# Altium project Thrust Stand Board.PrjPcb
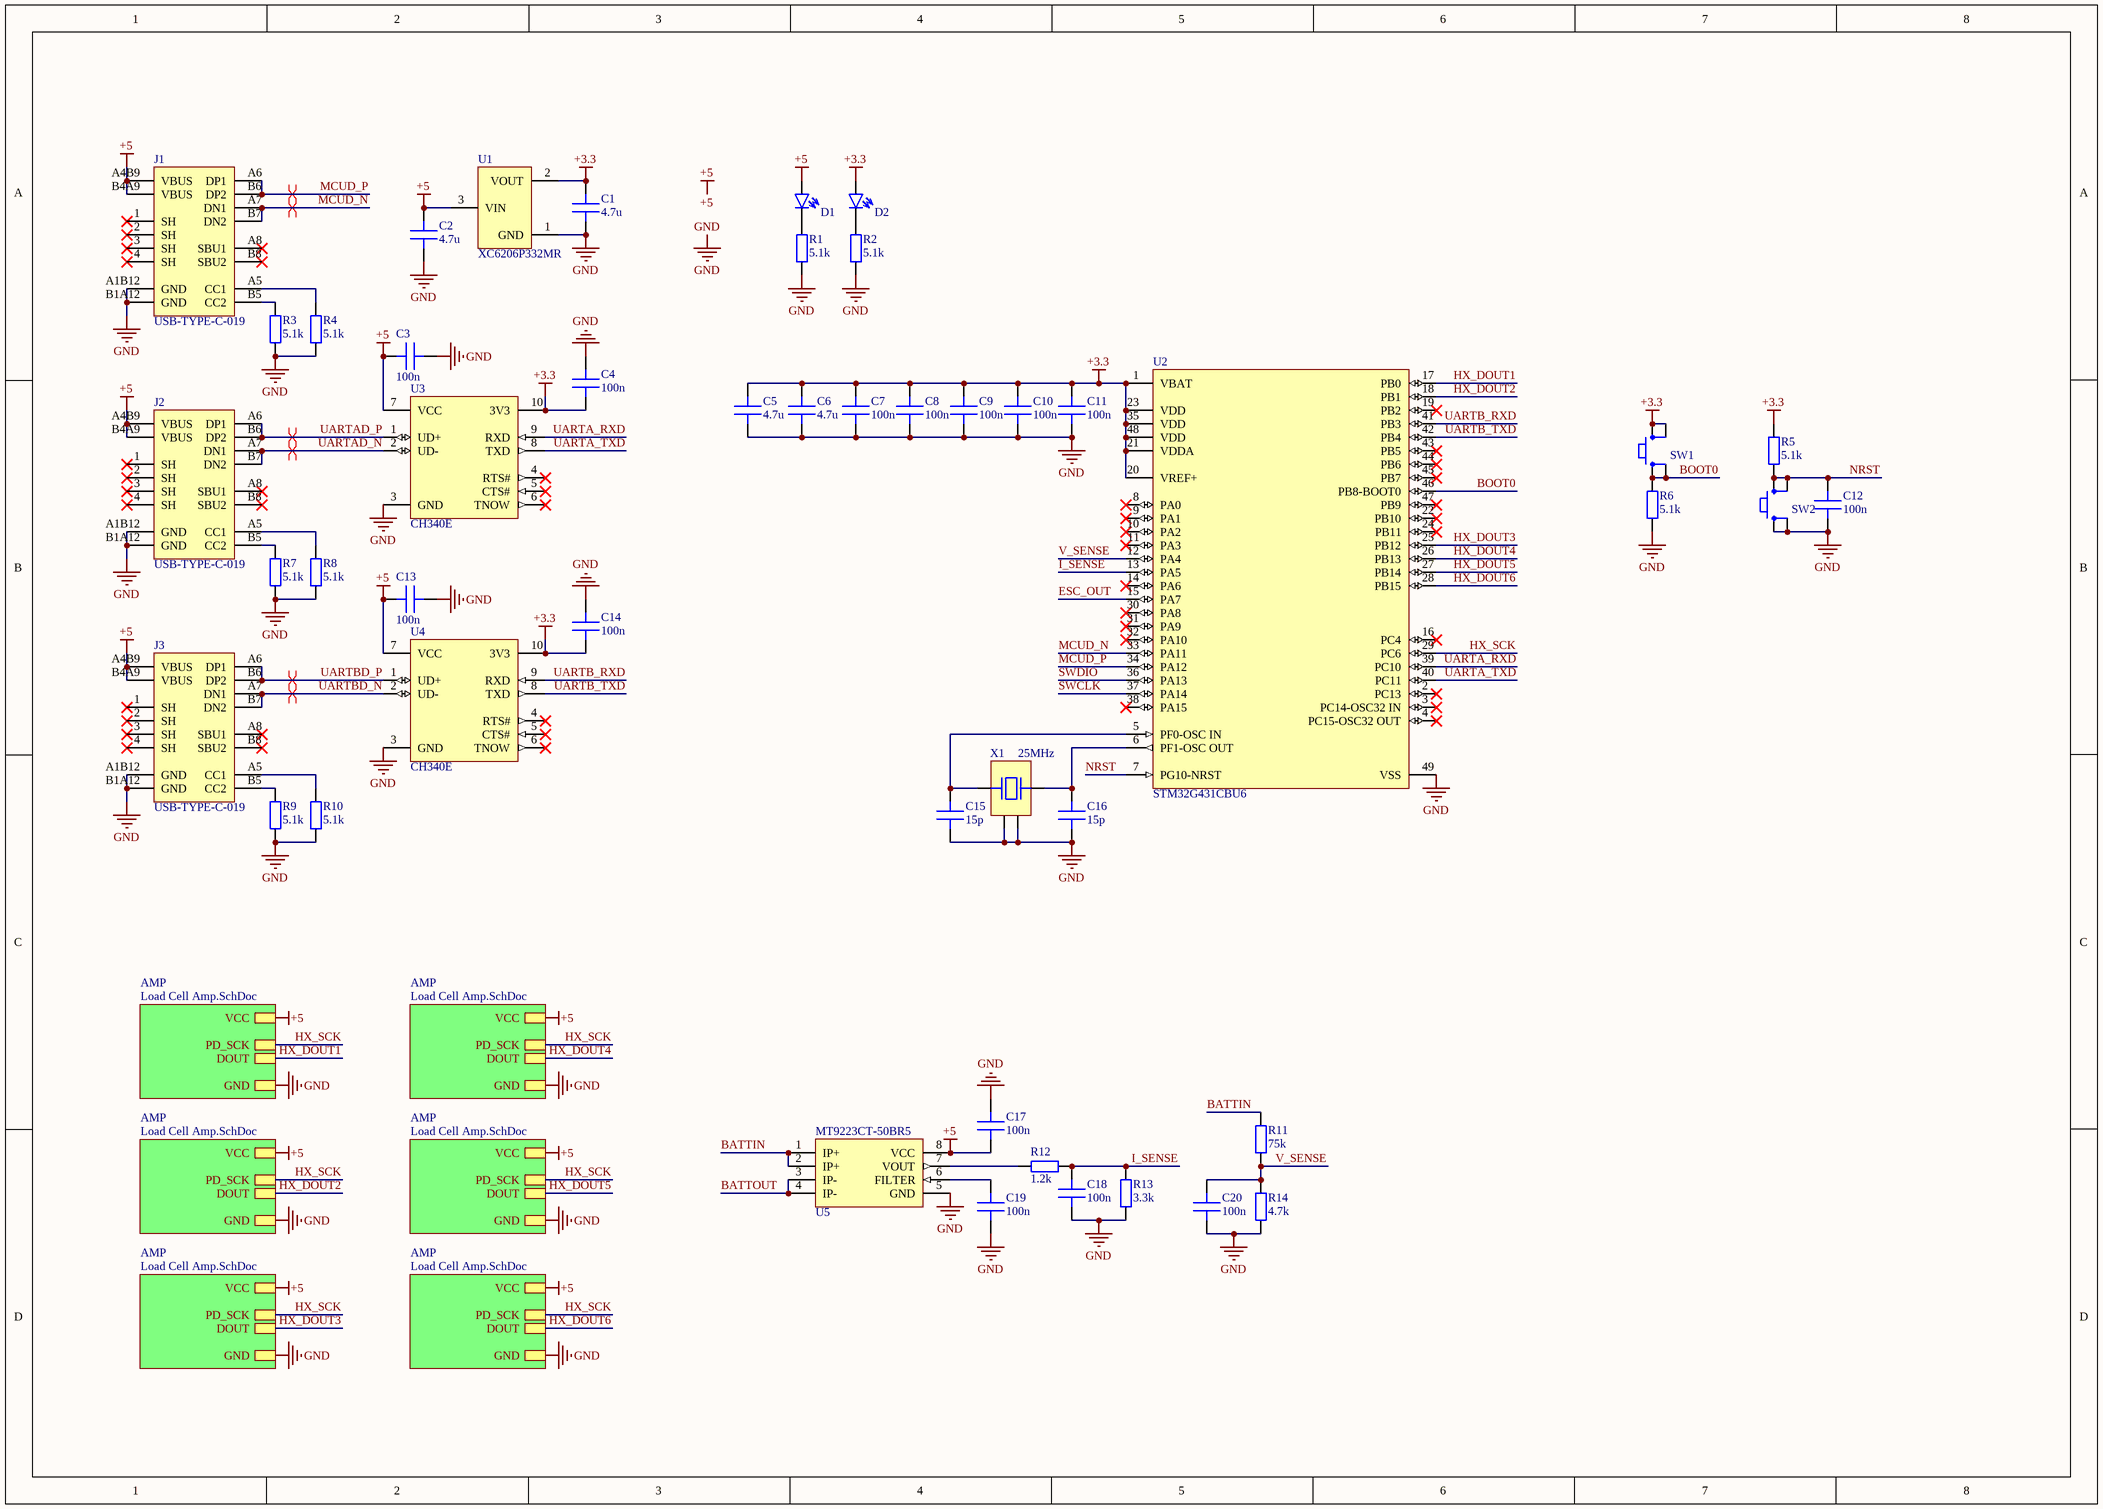
[diagram p0: Main.SchDoc]
1 sheet, 47 parts. Net scope: hierarchical (ports join the sheet entries above them; power ports are global).
Board files: Thrust Stand Board.PcbDoc, Panel.PcbDoc

## Sheet Main.SchDoc
size A3

### Parts
C1  4.7u  [IPC C C0603 NO SILK]
C2  4.7u  [IPC C C0603 NO SILK]
C3  100n  [IPC C C0402 NO SILK]
C4  100n  [IPC C C0402 NO SILK]
C5  4.7u  [IPC C C0603 NO SILK]
C6  4.7u  [IPC C C0603 NO SILK]
C7  100n  [IPC C C0402 NO SILK]
C8  100n  [IPC C C0402 NO SILK]
C9  100n  [IPC C C0402 NO SILK]
C10  100n  [IPC C C0402 NO SILK]
C11  100n  [IPC C C0402 NO SILK]
C12  100n  [IPC C C0402 NO SILK]
C13  100n  [IPC C C0402 NO SILK]
C14  100n  [IPC C C0402 NO SILK]
C15  15p  [IPC C C0402 NO SILK]
C16  15p  [IPC C C0402 NO SILK]
C17  100n  [IPC C C0402 NO SILK]
C18  100n  [IPC C C0402 NO SILK]
C19  100n  [IPC C C0402 NO SILK]
C20  100n  [IPC C C0402 NO SILK]
D1  Generic LED 0603  [IPC C D0603]  (value not drawn)
D2  Generic LED 0603  [IPC C D0603]  (value not drawn)
J1  USB-TYPE-C-019  [USB-TYPE-C-12+4P]
J2  USB-TYPE-C-019  [USB-TYPE-C-12+4P]
J3  USB-TYPE-C-019  [USB-TYPE-C-12+4P]
R1  5.1k  [IPC C R0402 NO SILK]
R2  5.1k  [IPC C R0402 NO SILK]
R3  5.1k  [IPC C R0402 NO SILK]
R4  5.1k  [IPC C R0402 NO SILK]
R5  5.1k  [IPC C R0402 NO SILK]
R6  5.1k  [IPC C R0402 NO SILK]
R7  5.1k  [IPC C R0402 NO SILK]
R8  5.1k  [IPC C R0402 NO SILK]
R9  5.1k  [IPC C R0402 NO SILK]
R10  5.1k  [IPC C R0402 NO SILK]
R11  75k  [IPC C R0402 NO SILK]
R12  1.2k  [IPC C R0402 NO SILK]
R13  3.3k  [IPC C R0402 NO SILK]
R14  4.7k  [IPC C R0402 NO SILK]
SW1  TS-1187A-B-A-B  [TS-1187A-B-A-B]  (value not drawn)
SW2  TS-1187A-B-A-B  [TS-1187A-B-A-B]  (value not drawn)
U1  XC6206P332MR  [SOT23-3]
U2  STM32G431CBU6  [QFN50P700X700X60_HS-49L]
U3  CH340E  [MSOP-UN10_L]
U4  CH340E  [MSOP-UN10_L]
U5  MT9223CT-50BR5  [SOP127P600X175-8L]
X1  25MHz  [OSC-SMD_4P-L3.2-W2.5-BL]

### Sub-sheets
AMP = Load Cell Amp.SchDoc (file not in this document): VCC, PD_SCK, DOUT, GND
AMP = Load Cell Amp.SchDoc (file not in this document): VCC, PD_SCK, DOUT, GND
AMP = Load Cell Amp.SchDoc (file not in this document): VCC, PD_SCK, DOUT, GND
AMP = Load Cell Amp.SchDoc (file not in this document): VCC, PD_SCK, DOUT, GND
AMP = Load Cell Amp.SchDoc (file not in this document): VCC, PD_SCK, DOUT, GND
AMP = Load Cell Amp.SchDoc (file not in this document): VCC, PD_SCK, DOUT, GND

### Nets
+3.3: C1.2 C4.2 C5.2 C6.2 C7.2 C8.2 C9.2 C10.2 C11.2 C14.2 D2.1(A) R5.2 SW1.3 SW1.4 U1.2(VOUT) U2.1(VBAT) U2.20(VREF+) U2.21(VDDA) U2.23(VDD) U2.35(VDD) U2.48(VDD) U3.10(3V3) U4.10(3V3)
+5: C2.2 C3.2 C13.2 C17.2 D1.1(A) J1.A4B9(VBUS) J1.B4A9(VBUS) J2.A4B9(VBUS) J2.B4A9(VBUS) J3.A4B9(VBUS) J3.B4A9(VBUS) U1.3(VIN) U3.7(VCC) U4.7(VCC) U5.8(VCC) ; sheet AMP/VCC, sheet AMP/VCC, sheet AMP/VCC, sheet AMP/VCC, sheet AMP/VCC, sheet AMP/VCC
GND: C1.1 C2.1 C3.1 C4.1 C5.1 C6.1 C7.1 C8.1 C9.1 C10.1 C11.1 C12.1 C13.1 C14.1 C15.1 C16.1 C17.1 C18.1 C19.1 C20.1 J1.A1B12(GND) J1.B1A12(GND) J2.A1B12(GND) J2.B1A12(GND) J3.A1B12(GND) J3.B1A12(GND) R1.1 R2.1 R3.1 R4.1 R6.2 R7.1 R8.1 R9.1 R10.1 R13.1 R14.1 SW2.1 SW2.2 U1.1(GND) U2.49(VSS) U3.3(GND) U4.3(GND) U5.5(GND) X1.2 X1.4 ; sheet AMP/GND, sheet AMP/GND, sheet AMP/GND, sheet AMP/GND, sheet AMP/GND, sheet AMP/GND
BATTIN: R11.2 U5.1(IP+) U5.2(IP+)
BATTOUT: U5.3(IP-) U5.4(IP-)
BOOT0: R6.1 SW1.1 SW1.2 U2.46(PB8-BOOT0)
ESC_OUT: U2.15(PA7)
HX_DOUT1: U2.17(PB0) ; sheet AMP/DOUT
HX_DOUT2: U2.18(PB1) ; sheet AMP/DOUT
HX_DOUT3: U2.25(PB12) ; sheet AMP/DOUT
HX_DOUT4: U2.26(PB13) ; sheet AMP/DOUT
HX_DOUT5: U2.27(PB14) ; sheet AMP/DOUT
HX_DOUT6: U2.28(PB15) ; sheet AMP/DOUT
HX_SCK: U2.29(PC6) ; sheet AMP/PD_SCK, sheet AMP/PD_SCK, sheet AMP/PD_SCK, sheet AMP/PD_SCK, sheet AMP/PD_SCK, sheet AMP/PD_SCK
I_SENSE: C18.2 R12.1 R13.2 U2.13(PA5)
MCUD_N: J1.A7(DN1) J1.B7(DN2) U2.33(PA11)
MCUD_P: J1.A6(DP1) J1.B6(DP2) U2.34(PA12)
NRST: C12.2 R5.1 SW2.3 SW2.4 U2.7(PG10-NRST)
SWCLK: U2.37(PA14)
SWDIO: U2.36(PA13)
UARTA_RXD: U2.39(PC10) U3.9(RXD)
UARTA_TXD: U2.40(PC11) U3.8(TXD)
UARTAD_N: J2.A7(DN1) J2.B7(DN2) U3.2(UD-)
UARTAD_P: J2.A6(DP1) J2.B6(DP2) U3.1(UD+)
UARTB_RXD: U2.41(PB3) U4.9(RXD)
UARTB_TXD: U2.42(PB4) U4.8(TXD)
UARTBD_N: J3.A7(DN1) J3.B7(DN2) U4.2(UD-)
UARTBD_P: J3.A6(DP1) J3.B6(DP2) U4.1(UD+)
V_SENSE: C20.2 R11.1 R14.2 U2.12(PA4)
NetC15_2: C15.2 U2.5(PF0-OSC_IN) X1.1
NetC16_2: C16.2 U2.6(PF1-OSC_OUT) X1.3
NetC19_2: C19.2 U5.6(FILTER)
NetD1_2: D1.2(C) R1.2
NetD2_2: D2.2(C) R2.2
NetJ1_A5: J1.A5(CC1) R4.2
NetJ1_B5: J1.B5(CC2) R3.2
NetJ2_A5: J2.A5(CC1) R8.2
NetJ2_B5: J2.B5(CC2) R7.2
NetJ3_A5: J3.A5(CC1) R10.2
NetJ3_B5: J3.B5(CC2) R9.2
NetR12_2: R12.2 U5.7(VOUT)

Not connected (* = marked no-connect by the designer): J1 1(SH)* 2(SH)* 3(SH)* 4(SH)* A8(SBU1)* B8(SBU2)*; J2 1(SH)* 2(SH)* 3(SH)* 4(SH)* A8(SBU1)* B8(SBU2)*; J3 1(SH)* 2(SH)* 3(SH)* 4(SH)* A8(SBU1)* B8(SBU2)*; U2 2(PC13)* 3(PC14-OSC32_IN)* 4(PC15-OSC32_OUT)* 8(PA0)* 9(PA1)* 10(PA2)* 11(PA3)* 14(PA6)* 16(PC4)* 19(PB2)* 22(PB10)* 24(PB11)* 30(PA8)* 31(PA9)* 32(PA10)* 38(PA15)* 43(PB5)* 44(PB6)* 45(PB7)* 47(PB9)*; U3 4(RTS#)* 5(CTS#)* 6(TNOW)*; U4 4(RTS#)* 5(CTS#)* 6(TNOW)*

### Layout directives
differential pair: MCUD_N, MCUD_P, UARTAD_N, UARTAD_P, UARTBD_N, UARTBD_P

### Library data of the parts
C1 C2 C5 C6 = Generic CAP 0603: Value: 4.7u
C3 C4 C7-C20 = Generic CAP 0402
  C3 C4 C7-C14 C17-C20: Value: 100n
  C15 C16: Value: 15p
J1-J3 = USB-TYPE-C-019: Connector Type:Type-C Standard:- Gender:Female Number of Contacts:16 Number of Ports:1 Mounting Style:Surface Mount Current Rating - Power (Max):3A Operating Temperature Range:-25℃~+85℃ Operating Temperature Range:-25℃~+85℃; Manufacturer: DEALON(德艺隆); Add into BOM: yes; Connector Type: Type-C; Gender: Female; Number of Contacts: 16; Number of Ports: 1; Current Rating - Power (Max): 3A; Symbol: USB-TYPE-C-019; Device: USB-TYPE-C-019; LCSC Part Name: Type-C 母座 卧贴; Supplier Part: C2927039; Manufacturer Part: USB-TYPE-C-019; Supplier Footprint: SMD; JLCPCB Part Class: Extended Part; Datasheet: https://atta.szlcsc.com/upload/public/pdf/source/20211217/CCD3D517E355E8E0CC52ABD8D5784AD8.pdf; Supplier: LCSC; Convert to PCB: yes; Standard: -; Mounting Style: Surface Mount; Operating Temperature Range: -25℃~+85℃
R1-R14 = Generic RES 0402
  R1-R10: Value: 5.1k
  R11: Value: 75k
  R12: Value: 1.2k
  R13: Value: 3.3k
  R14: Value: 4.7k
SW1 SW2 = Push Button TS-1187A-B-A-B: Add into BOM: yes; Symbol: TS-1187A-B-A-B; Device: TS-1187A-B-A-B; Supplier Part: C318884; Manufacturer Part: TS-1187A-B-A-B; JLCPCB Part Class: Basic Part; Supplier: LCSC; Convert to PCB: yes
U1 = 3.3V Regulator XC6206P332MR_C5446: Output Type: Output Polarity:Positive Number of Outputs:1 Maximum Input Voltage:6V Output Voltage:3.3V~3.3V Output Voltage:3.3V~3.3V Dropout Voltage:680mV@(100mA) Output Current:200mA Power Supply Rejection Ratio (PSRR):-; Manufacturer: TOREX(特瑞仕); Add into BOM: yes; Number of Outputs: 1; Maximum Input Voltage: 6V; Output Current: 200mA; Symbol: XC6206P332MR; Device: XC6206P332MR_C5446; LCSC Part Name: 正 Vin=6V Vout=3.3V 200mA; Supplier Part: C5446; Manufacturer Part: XC6206P332MR; Supplier Footprint: SOT-23-3L; JLCPCB Part Class: Basic Part; Datasheet: https://atta.szlcsc.com/upload/public/pdf/source/20130801/1457706628791.pdf; Supplier: LCSC; Convert to PCB: yes; Output Polarity: Positive; Output Voltage: 3.3V~3.3V; Dropout Voltage: 680mV@(100mA); Power Supply Rejection Ratio (PSRR): -
U5 = MT9223CT-XXXR5
X1 = Crystal 25MHz X322525MOB4SI: Crystal Type:SMD Crystal Resonator Frequency: Frequency Tolerance:±10ppm Frequency Tolerance:±10ppm Frequency Stability:±30ppm Frequency Stability:±30ppm Load Capacitance: Operating Temperature: Operating Temperature:; Manufacturer: YXC(扬兴晶振); Add into BOM: yes; Frequency Tolerance: ±10ppm; Frequency Stability: ±30ppm; Symbol: X322525MOB4SI; Device: X322525MOB4SI; LCSC Part Name: 25MHz ±10ppm 12pF; Supplier Part: C9006; Manufacturer Part: X322525MOB4SI; Supplier Footprint: SMD3225-4P; JLCPCB Part Class: Basic Part; Datasheet: https://atta.szlcsc.com/upload/public/pdf/source/20210329/C112971_1F611BDC486E193C1706F6D8EB5AA189.pdf; Supplier: LCSC; Convert to PCB: yes; Crystal Type: SMD Crystal Resonator; Value: 25MHz